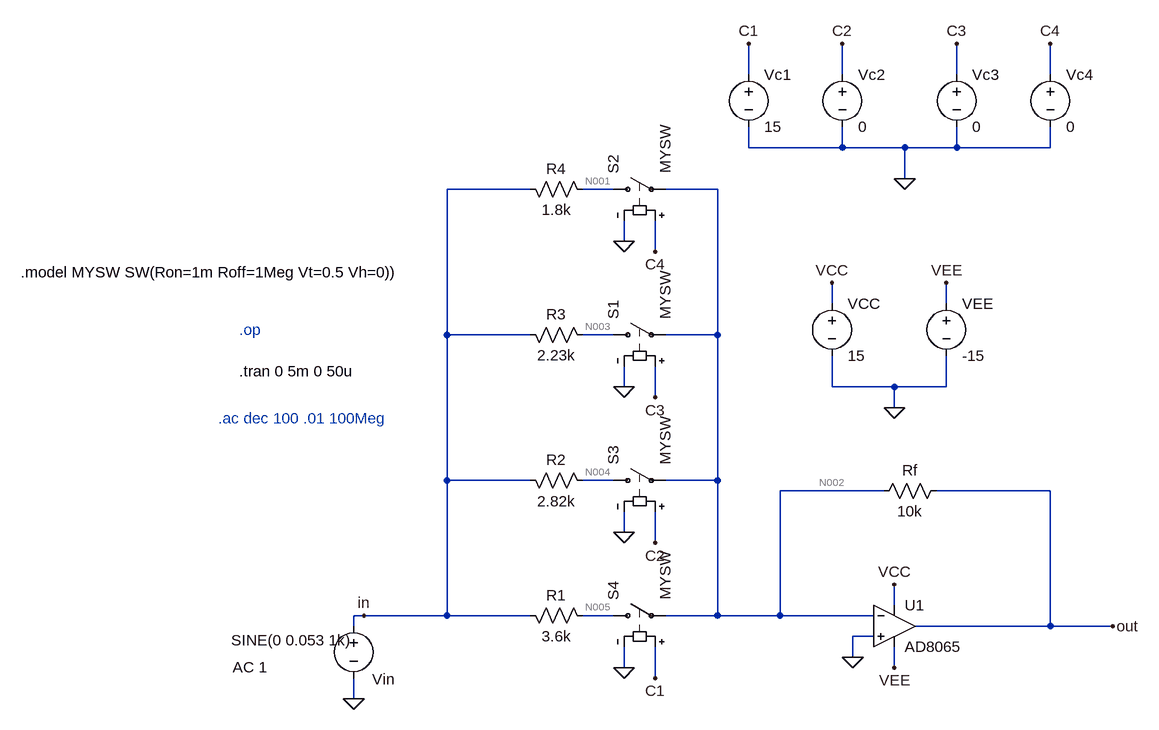
[diagram p0: schematic etaj3.asc]
etaj3.asc, the LTspice schematic file:
Version 4
SHEET 1 1464 680
WIRE 304 -432 304 -480
WIRE 448 -432 448 -480
WIRE 624 -432 624 -480
WIRE 768 -432 768 -480
WIRE 304 -320 304 -352
WIRE 448 -320 448 -352
WIRE 448 -320 304 -320
WIRE 544 -320 448 -320
WIRE 624 -320 624 -352
WIRE 624 -320 544 -320
WIRE 768 -320 768 -352
WIRE 768 -320 624 -320
WIRE 544 -272 544 -320
WIRE -32 -256 -160 -256
WIRE 96 -256 48 -256
WIRE 256 -256 176 -256
WIRE 112 -176 112 -208
WIRE 160 -160 160 -208
WIRE 432 -80 432 -112
WIRE 608 -80 608 -112
WIRE -160 -32 -160 -256
WIRE -32 -32 -160 -32
WIRE 96 -32 48 -32
WIRE 256 -32 256 -256
WIRE 256 -32 176 -32
WIRE 112 48 112 16
WIRE 432 48 432 0
WIRE 528 48 432 48
WIRE 608 48 608 0
WIRE 608 48 528 48
WIRE 160 64 160 16
WIRE 528 80 528 48
WIRE -160 192 -160 -32
WIRE -32 192 -160 192
WIRE 96 192 48 192
WIRE 256 192 256 -32
WIRE 256 192 176 192
WIRE 512 208 352 208
WIRE 768 208 592 208
WIRE 112 272 112 240
WIRE 160 288 160 240
WIRE 528 384 528 352
WIRE -288 400 -304 400
WIRE -160 400 -160 192
WIRE -160 400 -288 400
WIRE -32 400 -160 400
WIRE 96 400 48 400
WIRE 256 400 256 192
WIRE 256 400 176 400
WIRE 352 400 352 208
WIRE 352 400 256 400
WIRE 496 400 352 400
WIRE -304 416 -304 400
WIRE 768 416 768 208
WIRE 768 416 560 416
WIRE 864 416 768 416
WIRE 496 432 464 432
WIRE 464 464 464 432
WIRE 112 480 112 448
WIRE 528 480 528 448
WIRE 160 496 160 448
WIRE -304 528 -304 496
FLAG 304 -480 C1
FLAG -304 528 0
FLAG 528 480 VEE
FLAG 528 352 VCC
FLAG 464 464 0
FLAG 864 416 out
FLAG -288 400 in
FLAG 448 -480 C2
FLAG 624 -480 C3
FLAG 768 -480 C4
FLAG 544 -272 0
FLAG 528 80 0
FLAG 432 -112 VCC
FLAG 608 -112 VEE
FLAG 112 -176 0
FLAG 112 48 0
FLAG 112 272 0
FLAG 112 480 0
FLAG 160 496 C1
FLAG 160 288 C2
FLAG 160 64 C3
FLAG 160 -160 C4
DATAFLAG -224 400 ""
SYMBOL voltage -304 400 R0
WINDOW 123 -186 79 Left 2
WINDOW 39 0 0 Left 2
WINDOW 0 29 98 Left 2
WINDOW 3 -188 38 Left 2
SYMATTR Value2 AC 1
SYMATTR InstName Vin
SYMATTR Value SINE(0 0.053 1k)
SYMBOL voltage 304 -448 R0
WINDOW 123 0 0 Left 2
WINDOW 39 0 0 Left 2
SYMATTR InstName Vc1
SYMATTR Value 15
SYMBOL res -48 176 M90
WINDOW 0 0 56 VBottom 2
WINDOW 3 32 56 VTop 2
SYMATTR InstName R2
SYMATTR Value 2.82k
SYMBOL res 608 192 R90
WINDOW 0 0 56 VBottom 2
WINDOW 3 32 56 VTop 2
SYMATTR InstName Rf
SYMATTR Value 10k
SYMBOL res -48 -48 M90
WINDOW 0 0 56 VBottom 2
WINDOW 3 32 56 VTop 2
SYMATTR InstName R3
SYMATTR Value 2.23k
SYMBOL res -48 -272 M90
WINDOW 0 0 56 VBottom 2
WINDOW 3 32 56 VTop 2
SYMATTR InstName R4
SYMATTR Value 1.8k
SYMBOL voltage 448 -448 R0
WINDOW 123 0 0 Left 2
WINDOW 39 0 0 Left 2
SYMATTR InstName Vc2
SYMATTR Value 0
SYMBOL voltage 624 -448 R0
WINDOW 123 0 0 Left 2
WINDOW 39 0 0 Left 2
SYMATTR InstName Vc3
SYMATTR Value 0
SYMBOL voltage 768 -448 R0
WINDOW 123 0 0 Left 2
WINDOW 39 0 0 Left 2
SYMATTR InstName Vc4
SYMATTR Value 0
SYMBOL voltage 432 -96 R0
WINDOW 123 0 0 Left 2
WINDOW 39 0 0 Left 2
SYMATTR InstName VCC
SYMATTR Value 15
SYMBOL voltage 608 -96 R0
WINDOW 123 0 0 Left 2
WINDOW 39 0 0 Left 2
SYMATTR InstName VEE
SYMATTR Value -15
SYMBOL res -48 384 M90
WINDOW 0 0 56 VBottom 2
WINDOW 3 32 56 VTop 2
SYMATTR InstName R1
SYMATTR Value 3.6k
SYMBOL OpAmps\\AD8065 528 352 R0
SYMATTR InstName U1
SYMBOL sw 80 -32 R270
SYMATTR InstName S1
SYMATTR Value MYSW
SYMBOL sw 80 -256 R270
SYMATTR InstName S2
SYMATTR Value MYSW
SYMBOL sw 80 192 R270
SYMATTR InstName S3
SYMATTR Value MYSW
SYMBOL sw 80 400 R270
SYMATTR InstName S4
SYMATTR Value MYSW
TEXT -480 24 Left 2 !.tran 0 5m 0 50u
TEXT -480 -40 Left 2 ;.op
TEXT -816 -128 Left 2 !.model MYSW SW(Ron=1m Roff=1Meg Vt=0.5 Vh=0))
TEXT -512 96 Left 2 ;.ac dec 100 .01 100Meg

The netlist it stands for:
* etaj3.asc
Vin in 0 SINE(0 0.053 1k) AC 1
Vc1 C1 0 15
R2 in N004 2.82k
Rf out N002 10k
R3 in N003 2.23k
R4 in N001 1.8k
Vc2 C2 0 0
Vc3 C3 0 0
Vc4 C4 0 0
VCC VCC 0 15
VEE VEE 0 -15
R1 in N005 3.6k
XU1 0 N002 VCC VEE out AD8065  ; pins In+ In- V+ V- OUT
S1 N003 N002 C3 0 MYSW
S2 N001 N002 C4 0 MYSW
S3 N004 N002 C2 0 MYSW
S4 N005 N002 C1 0 MYSW
.tran 0 5m 0 50u
* .op
.model MYSW SW(Ron=1m Roff=1Meg Vt=0.5 Vh=0))
* .ac dec 100 .01 100Meg
.backanno
.end

* Results of the author's LTspice run, read from the files saved beside the schematic
* Operating Point, zero values left out:
*   V(c1) = 15 V
*   V(n004) = -1.125 µV
*   V(out) = -1.523 mV
*   V(n002) = -400 µV
*   V(n003) = -890 nV
*   V(n001) = -718.7 nV
*   V(vcc) = 15 V
*   V(vee) = -15 V
*   V(n005) = -400 µV
*   I(R2) = 398.9 pA
*   I(Rf) = -112.3 nA
*   I(R3) = 399.1 pA
*   I(R4) = 399.3 pA
*   I(R1) = 111.1 nA
*   I(S1) = -399.1 pA
*   I(S2) = -399.3 pA
*   I(S3) = -398.9 pA
*   I(S4) = -111.1 nA
*   I(Vin) = -112.3 nA
*   I(Vcc) = -6.402 mA
*   I(Vee) = 6.402 mA
*   Ix(u1:100) = -3.04 pA
*   Ix(u1:101) = -1.04 pA
*   Ix(u1:102) = 6.402 mA
*   Ix(u1:103) = -6.402 mA
*   Ix(u1:104) = 112.3 nA
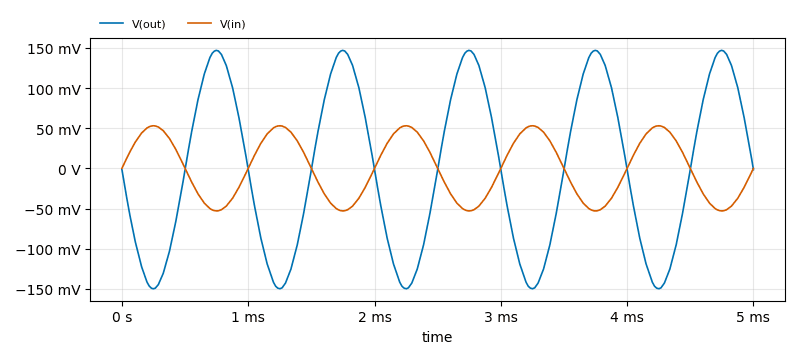
[diagram p1: Transient Analysis of etaj3.asc, plotted from the saved traces]
* Transient Analysis, 1 run:
*   V(out): min -150 mV, max 146.9 mV, average -1.491 mV, rms 103.9 mV, last -1.515 mV
*   V(in): min -52.99 mV, max 53 mV, average -3.54 µV, rms 37.51 mV, last 0 V